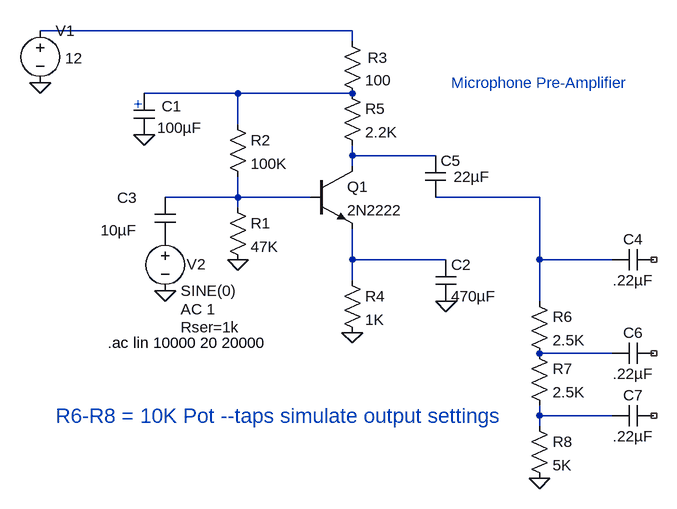
[diagram p0: schematic P3ST_Mic_Amp.asc]
P3ST_Mic_Amp.asc, the LTspice schematic file:
Version 4
SHEET 1 1276 724
WIRE 240 -32 -240 -32
WIRE 240 -16 240 -32
WIRE 64 64 -80 64
WIRE 240 64 64 64
WIRE 64 112 64 64
WIRE 240 160 240 144
WIRE 368 160 240 160
WIRE 240 176 240 160
WIRE 64 224 64 192
WIRE 64 224 -48 224
WIRE 176 224 64 224
WIRE 528 224 368 224
WIRE 64 240 64 224
WIRE 240 320 240 272
WIRE 384 320 240 320
WIRE 528 320 528 224
WIRE 640 320 528 320
WIRE 240 352 240 320
WIRE 528 384 528 320
WIRE 640 464 528 464
WIRE 528 560 528 544
WIRE 640 560 528 560
WIRE 528 576 528 560
FLAG 240 432 0
FLAG 64 320 0
FLAG -80 128 0
FLAG -48 368 0
FLAG -240 48 0
FLAG 528 656 0
FLAG 384 384 0
SYMBOL res 48 224 R0
SYMATTR InstName R1
SYMATTR Value 47K
SYMBOL res 48 96 R0
SYMATTR InstName R2
SYMATTR Value 100K
SYMBOL res 224 -32 R0
WINDOW 0 40 41 Left 2
SYMATTR InstName R3
SYMATTR Value 100
SYMBOL res 224 336 R0
SYMATTR InstName R4
SYMATTR Value 1K
SYMBOL npn 176 176 R0
SYMATTR InstName Q1
SYMATTR Value 2N2222
SYMBOL cap -96 64 R0
WINDOW 0 43 20 Left 2
WINDOW 3 36 53 Left 2
SYMATTR InstName C1
SYMATTR Value 100µF
SYMBOL res 224 48 R0
SYMATTR InstName R5
SYMATTR Value 2.2K
SYMBOL cap 352 160 R0
WINDOW 3 44 32 Left 2
SYMATTR Value 22µF
SYMATTR InstName C5
SYMBOL voltage -240 -48 R0
WINDOW 3 38 58 Left 2
SYMATTR Value 12
SYMATTR InstName V1
SYMBOL voltage -48 272 R0
WINDOW 123 24 124 Left 2
WINDOW 39 24 152 Left 2
WINDOW 0 33 55 Left 2
SYMATTR Value2 AC 1
SYMATTR SpiceLine Rser=1k
SYMATTR InstName V2
SYMATTR Value SINE(0)
SYMBOL cap -64 224 R0
WINDOW 0 -58 1 Left 2
WINDOW 3 -83 51 Left 2
SYMATTR InstName C3
SYMATTR Value 10µF
SYMBOL res 512 560 R0
SYMATTR InstName R8
SYMATTR Value 5K
SYMBOL cap 704 304 R90
WINDOW 0 0 32 VBottom 2
WINDOW 3 32 32 VTop 2
SYMATTR InstName C4
SYMATTR Value .22µF
SYMBOL res 512 368 R0
SYMATTR InstName R6
SYMATTR Value 2.5K
SYMBOL res 512 448 R0
SYMATTR InstName R7
SYMATTR Value 2.5K
SYMBOL cap 704 448 R90
WINDOW 0 0 32 VBottom 2
WINDOW 3 32 32 VTop 2
SYMATTR InstName C6
SYMATTR Value .22µF
SYMBOL cap 704 544 R90
WINDOW 0 0 32 VBottom 2
WINDOW 3 32 32 VTop 2
SYMATTR InstName C7
SYMATTR Value .22µF
SYMBOL cap 368 320 R0
SYMATTR InstName C2
SYMATTR Value 470µF
TEXT -136 448 Left 2 !.ac lin 10000 20 20000
TEXT -96 80 Left 2 ;+
TEXT 392 48 Left 2 ;Microphone Pre-Amplifier
TEXT -216 560 Left 3 ;R6-R8 = 10K Pot --taps simulate output settings

The netlist it stands for:
* P3ST_Mic_Amp.asc
R1 N004 0 47K
R2 N002 N004 100K
R3 N001 N002 100
R4 N006 0 1K
Q1 N003 N004 N006 0 2N2222
C1 N002 0 100µF
R5 N002 N003 2.2K
C5 N003 N005 22µF
V1 N001 0 12
V2 P001 0 SINE(0) AC 1 Rser=1k
C3 N004 P001 10µF
R8 N008 0 5K
C4 NC_01 N005 .22µF
R6 N005 N007 2.5K
R7 N007 N008 2.5K
C6 NC_02 N007 .22µF
C7 NC_03 N008 .22µF
C2 N006 0 470µF
.model NPN NPN
.model PNP PNP
.lib standard.bjt
.ac lin 10000 20 20000
* +
* Microphone Pre-Amplifier
* R6-R8 = 10K Pot --taps simulate output settings
.backanno
.end